# Altium project Nixie Alarm Clock - Base.PrjPcb
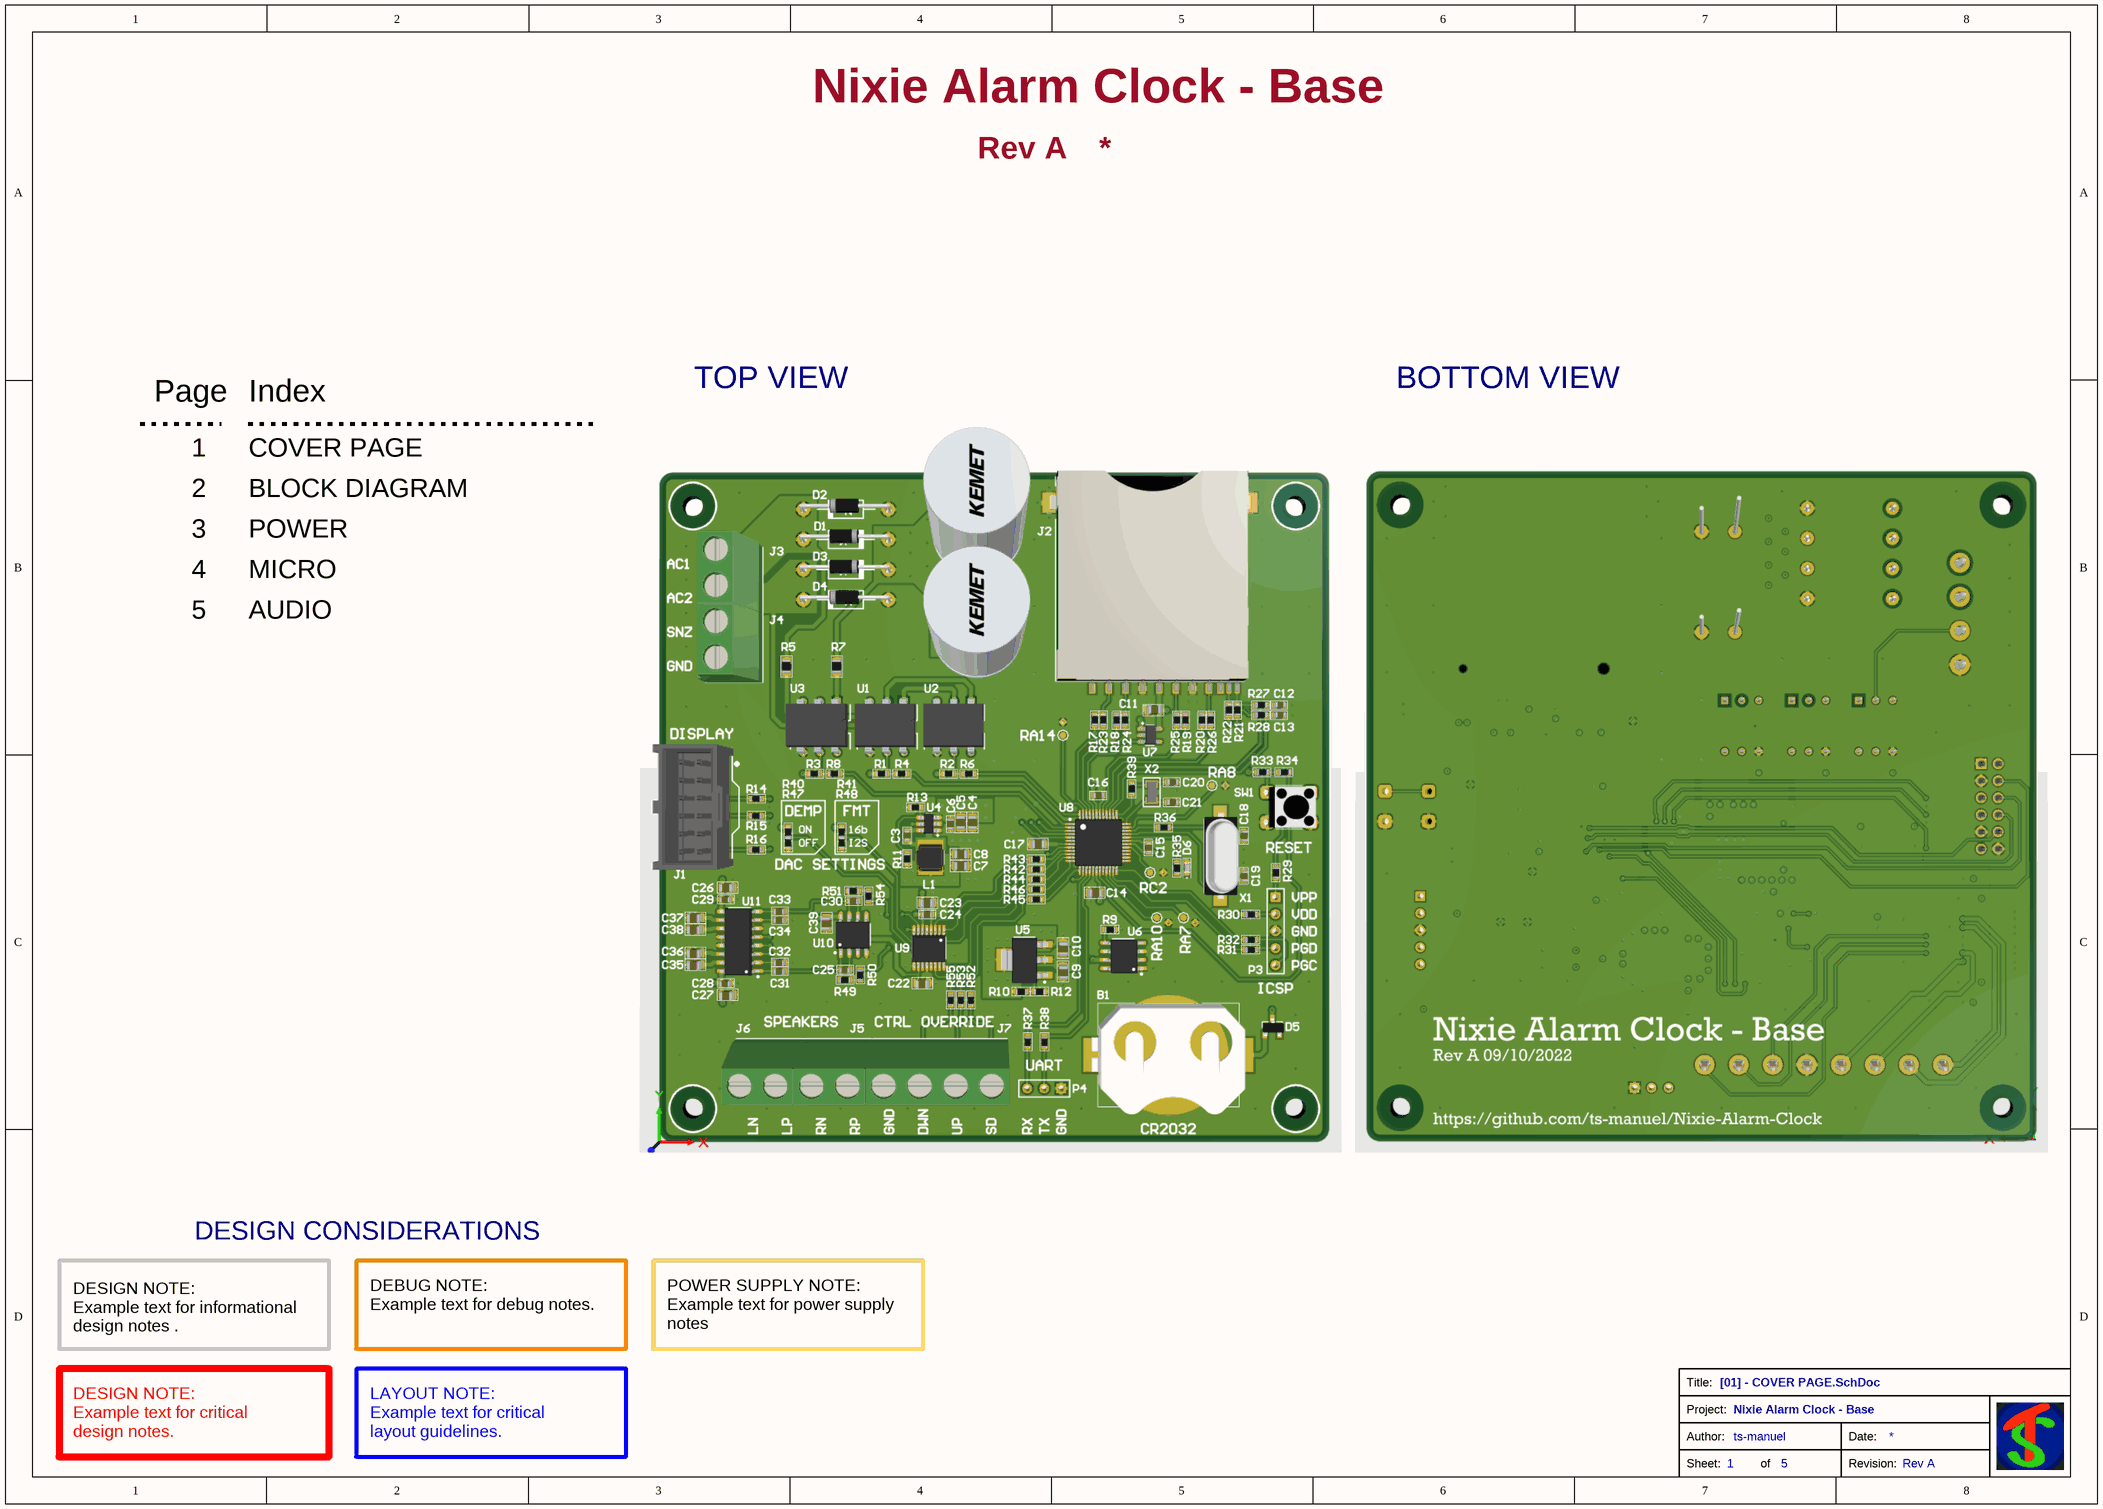
[diagram p0: [01] - COVER PAGE.SchDoc]
AuthorName: ts-manuel; GitHub: https://github.com/ts-manuel/Nixie-Alarm-Clock; ProjectRevision: Rev A; ProjectTitle: Nixie Alarm Clock - Base
5 sheets, 130 parts. Net scope: flat (ports and power ports of the same name join across sheets).
Board file: Base.PcbDoc
Sheets:
  [01] - COVER PAGE.SchDoc
  [02] - BLOCK DIAGRAM.SchDoc
  [03] - POWER.SchDoc
  [04] - MICRO.SchDoc
  [05] - AUDIO.SchDoc

## Sheet [01] - COVER PAGE.SchDoc
size A3; DocumentNumber: 1; SheetNumber: 1; SheetTotal: 5

### Notes on the sheet
- Page
- Index
- TOP VIEW
- BOTTOM VIEW
- 1
- 2
- COVER PAGE
- BLOCK DIAGRAM
- 3
- 4
- POWER
- MICRO
- 5
- AUDIO
- DESIGN CONSIDERATIONS
- DESIGN NOTE:
  Example text for informational
  design notes .
- DEBUG NOTE:
  Example text for debug notes.
- POWER SUPPLY NOTE:
  Example text for power supply notes
- DESIGN NOTE:
  Example text for critical
  design notes.
- LAYOUT NOTE:
  Example text for critical
  layout guidelines.
- Title:
- Project:
- Sheet:
- Author:
- of
- Revision:
- Date:

## Sheet [02] - BLOCK DIAGRAM.SchDoc
size A3; DocumentNumber: 2; SheetNumber: 2; SheetTotal: 5
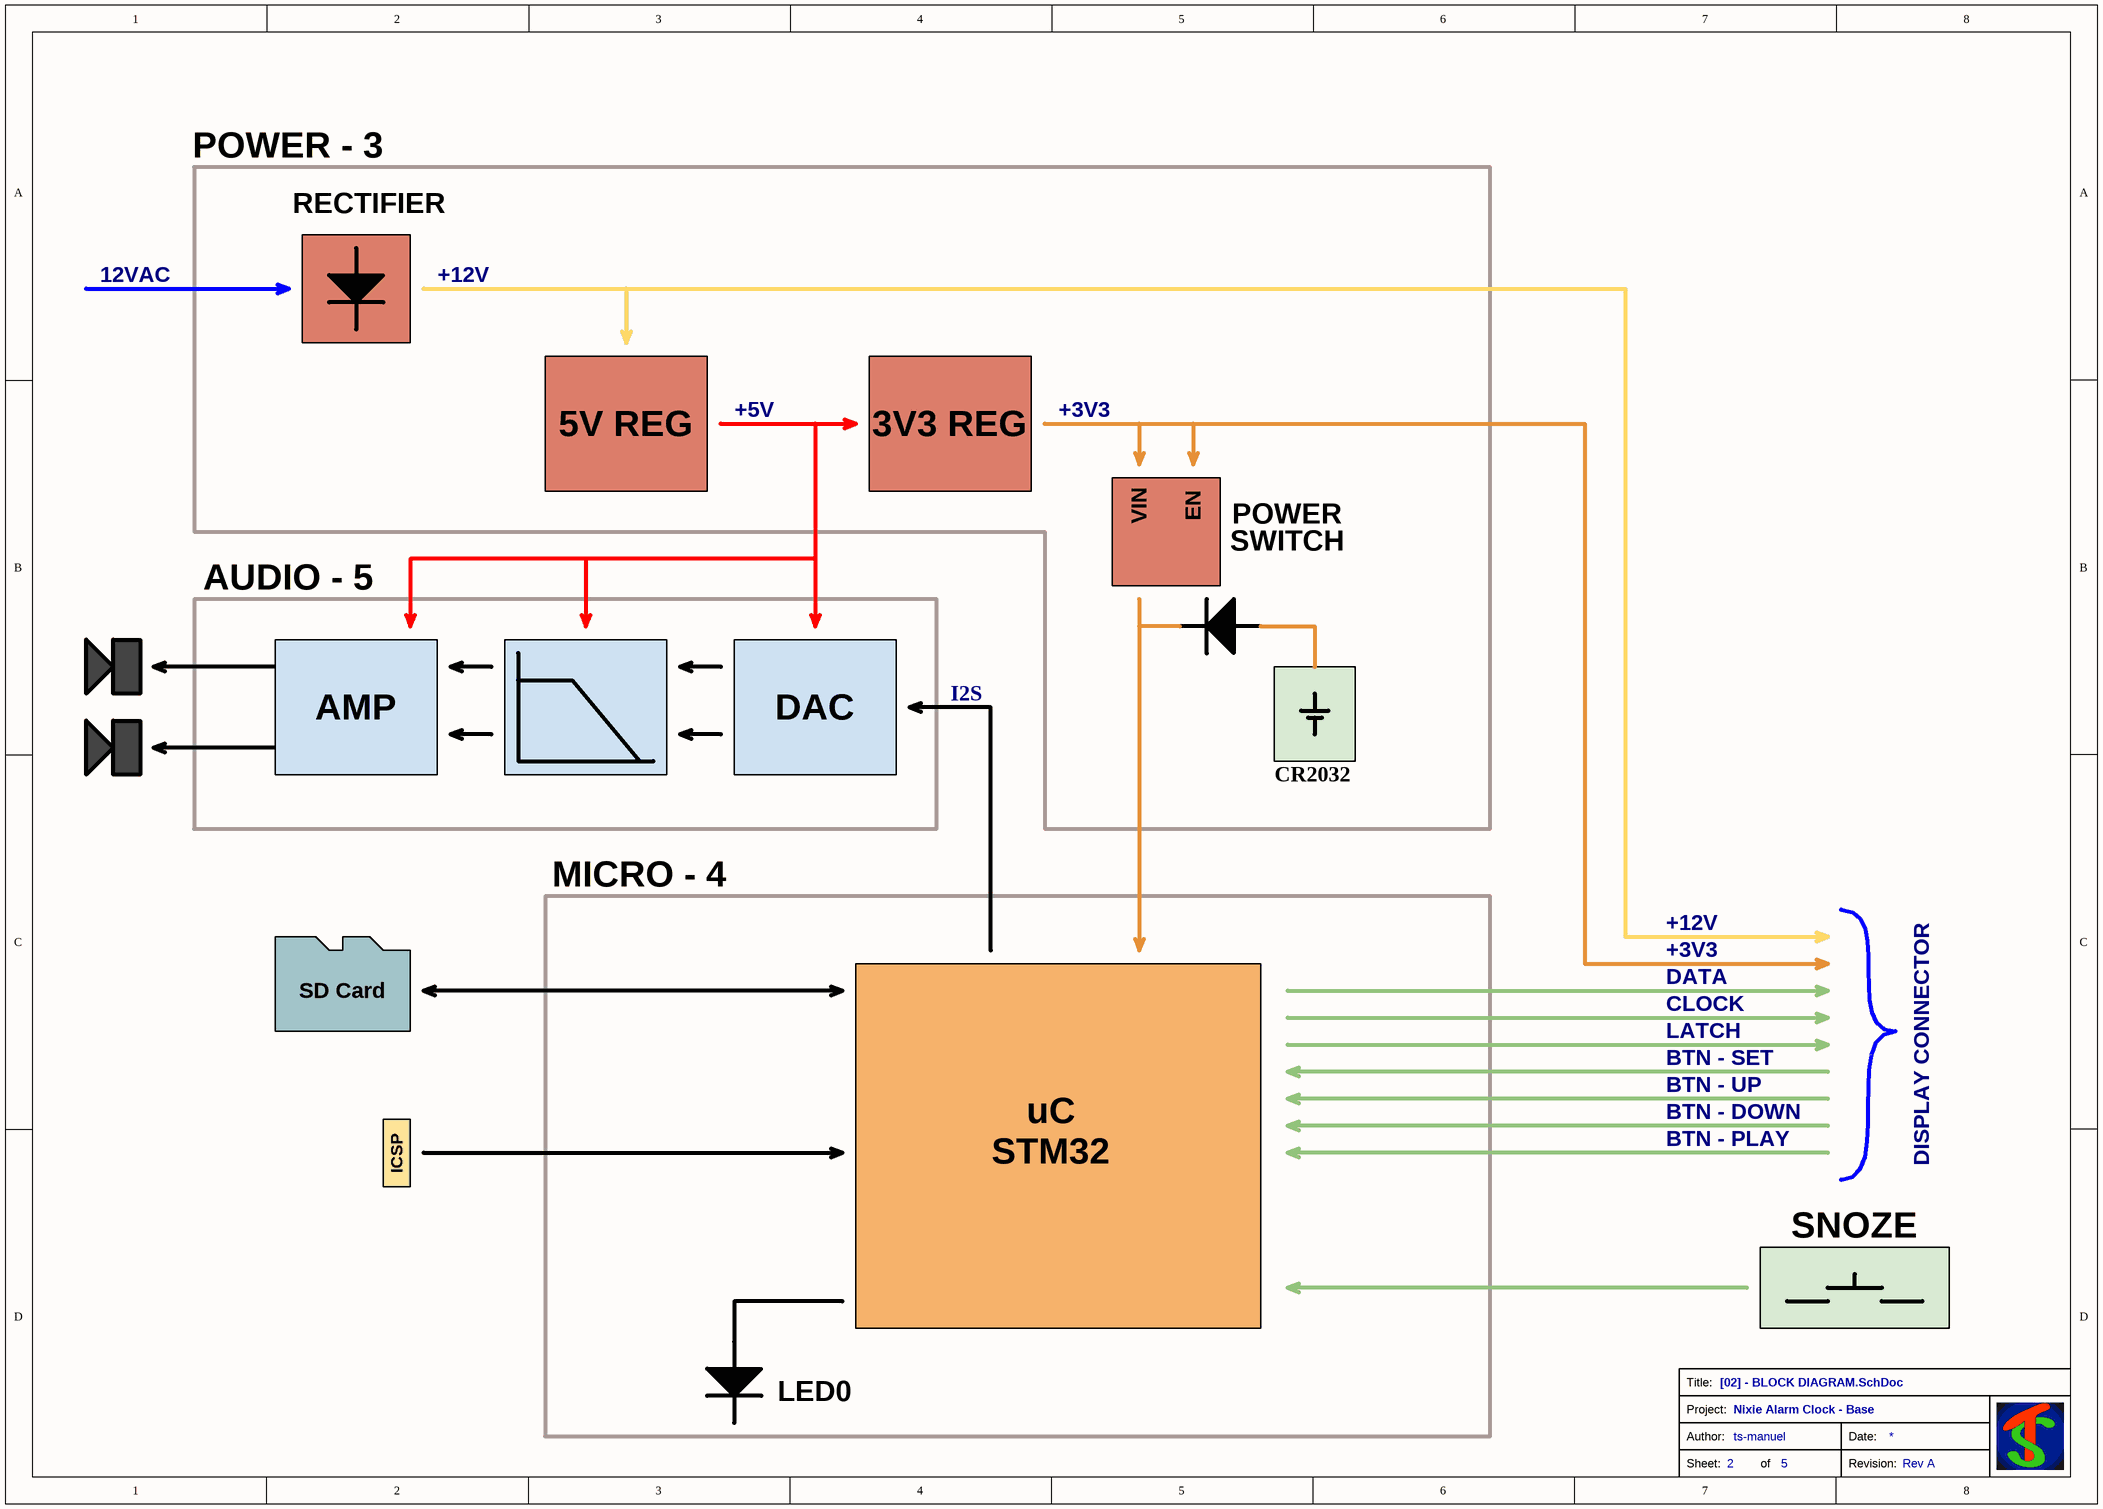
[diagram p1: [02] - BLOCK DIAGRAM.SchDoc]

### Notes on the sheet
- POWER - 3
- RECTIFIER
- 12VAC
- +12V
- 5V REG
- +5V
- 3V3 REG
- +3V3
- VIN
- EN
- SWITCH
- POWER
- AUDIO - 5
- AMP
- DAC
- I2S
- CR2032
- MICRO - 4
- SD Card
- DATA
- CLOCK
- LATCH
- uC
- BTN - SET
- BTN - UP
- BTN - DOWN
- ICSP
- STM32
- BTN - PLAY
- DISPLAY CONNECTOR
- SNOZE
- LED0
- Title:
- Project:
- Sheet:
- Author:
- of
- Revision:
- Date:

## Sheet [03] - POWER.SchDoc
size A3; DocumentNumber: 3; SheetNumber: 3; SheetTotal: 5
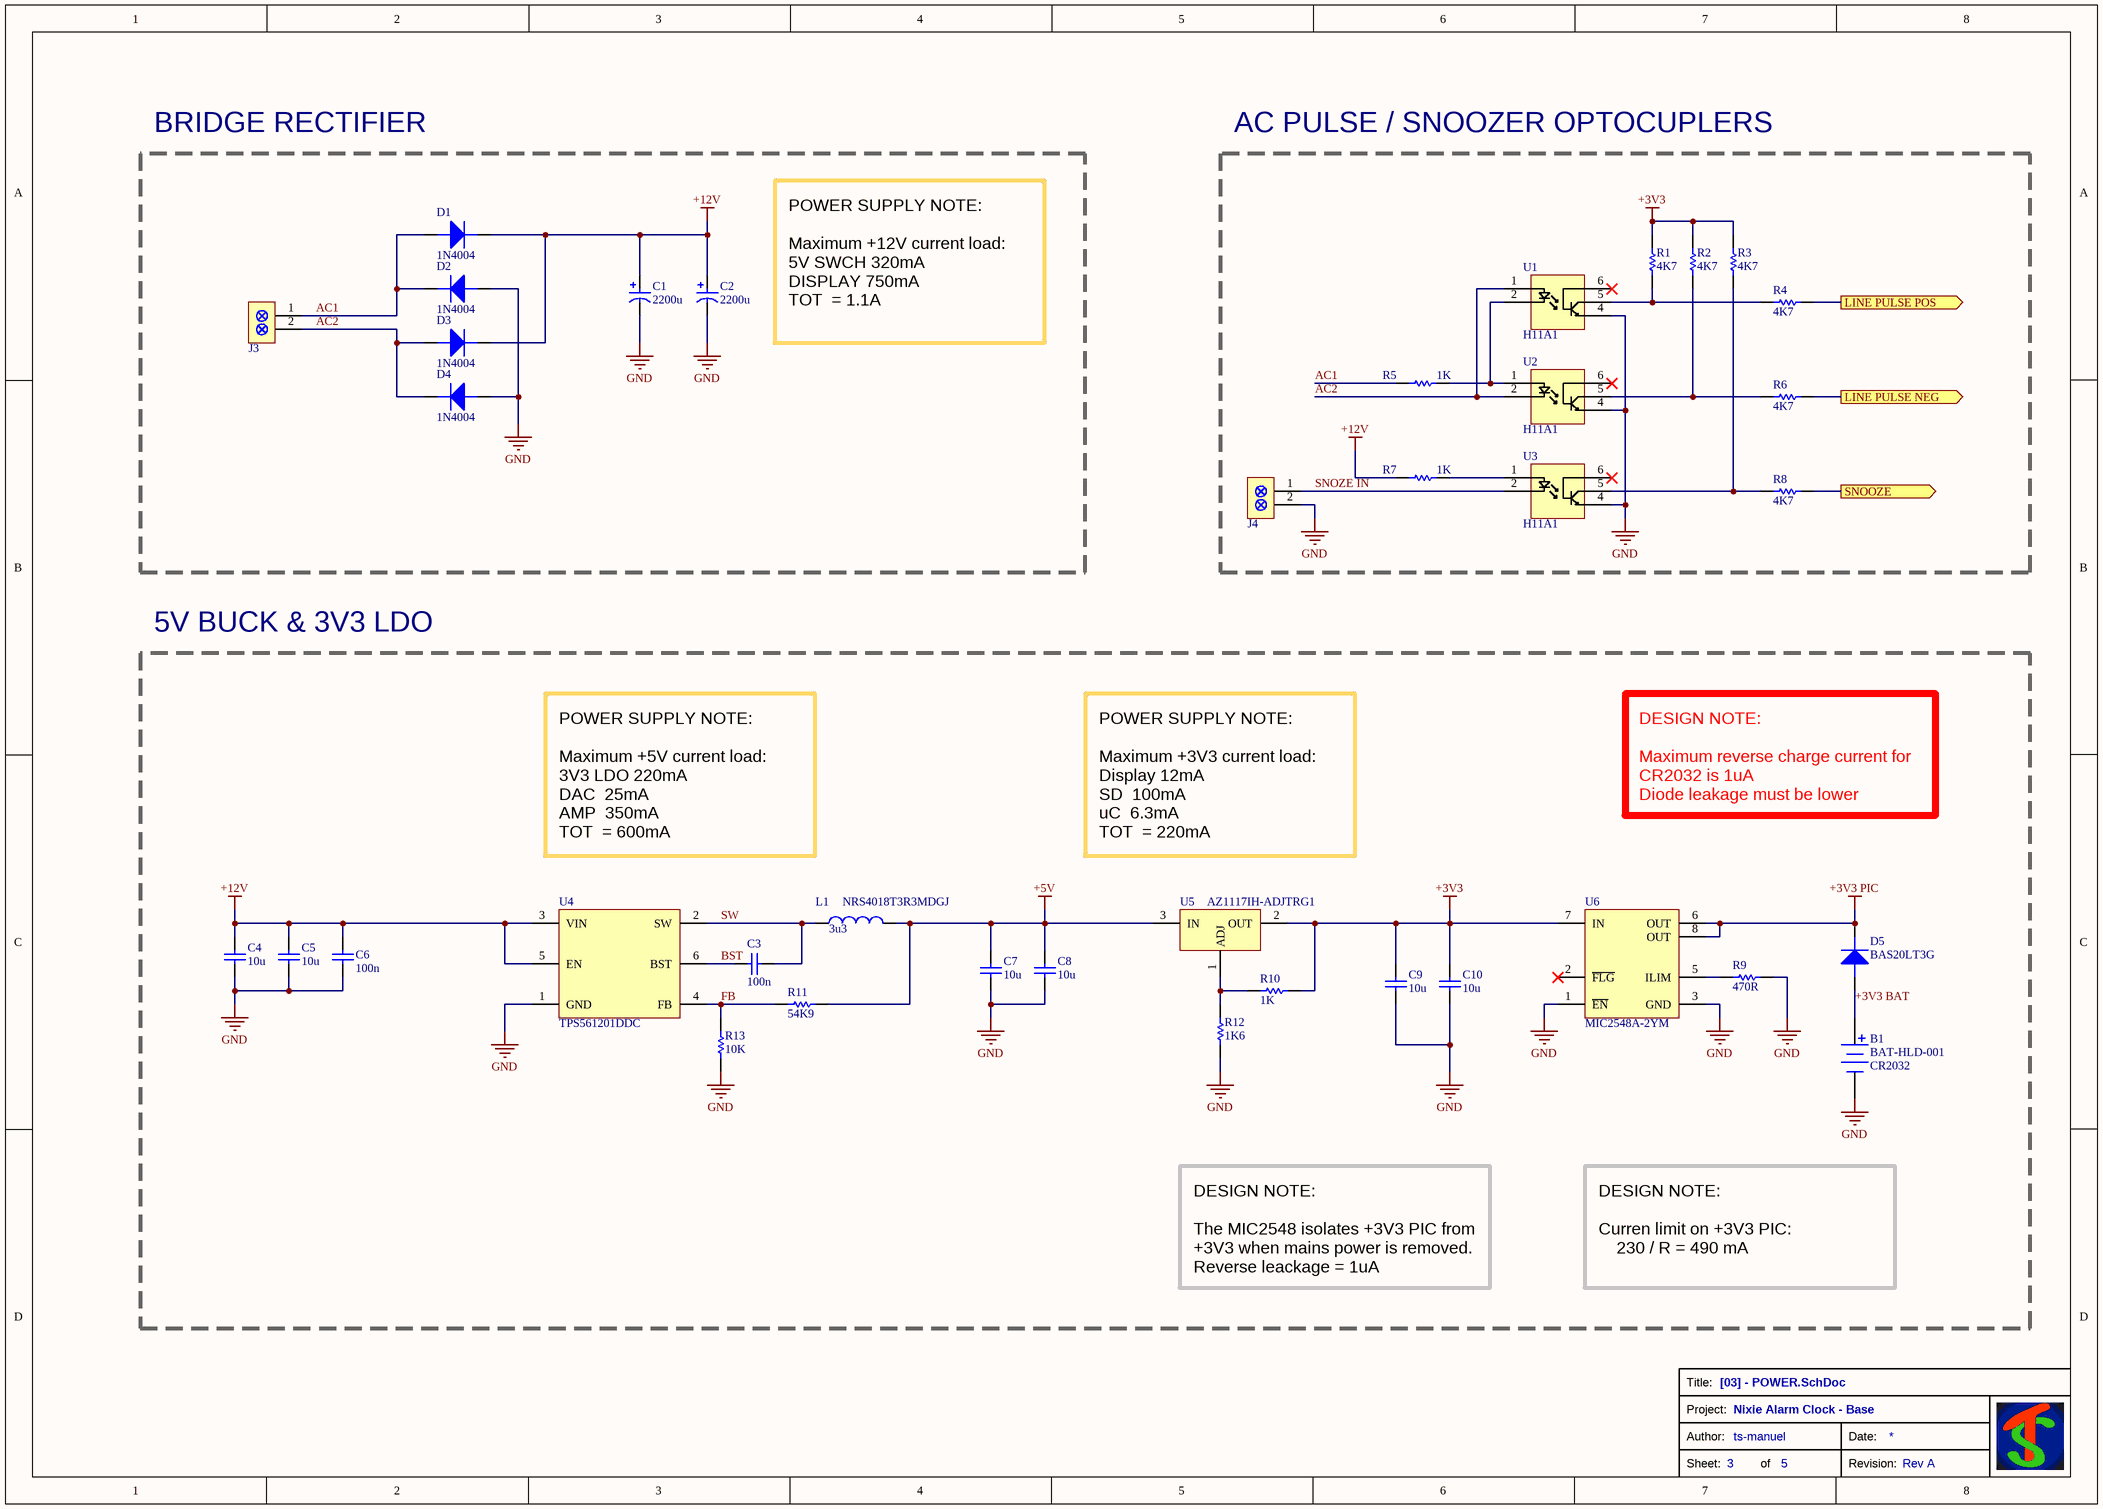
[diagram p2: [03] - POWER.SchDoc]

### Parts
B1  BAT-HLD-001  Size: CR2032  [BATHLD001-CR2032]
C1  value 2200u  [CAPPRD500W60D1300H2700]  (hidden comment: ESK228M025AL4AA)
C2  value 2200u  [CAPPRD500W60D1300H2700]  (hidden comment: ESK228M025AL4AA)
C3  value 100n  [CAP-0603]  (hidden comment: C0603C104M4RAC)
C4  value 10u  [CAP-0805]  (hidden comment: CL21A106KAYNNN)
C5  value 10u  [CAP-0805]  (hidden comment: CL21A106KAYNNN)
C6  value 100n  [CAP-0603]  (hidden comment: C0603C104M4RAC)
C7  value 10u  [CAP-0805]  (hidden comment: CL21A106KAYNNN)
C8  value 10u  [CAP-0805]  (hidden comment: CL21A106KAYNNN)
C9  value 10u  [CAP-0805]  (hidden comment: CL21A106KAYNNN)
C10  value 10u  [CAP-0805]  (hidden comment: CL21A106KAYNNN)
D1  1N4004  [DIODE-DO41]
D2  1N4004  [DIODE-DO41]
D3  1N4004  [DIODE-DO41]
D4  1N4004  [DIODE-DO41]
D5  BAS20LT3G  [SOT95P240X110-3N]
J3  SCREW-TH-BLOCK-200-2  [SCREW-TH-BLOCK-200-2]  (value not drawn)
J4  SCREW-TH-BLOCK-200-2  [SCREW-TH-BLOCK-200-2]  (value not drawn)
L1  NRS4018T3R3MDGJ  value 3u3  [INDP4040X18M]
R1  value 4K7  [RES-0603]  (hidden comment: RC0603FR-074K7L)
R2  value 4K7  [RES-0603]  (hidden comment: RC0603FR-074K7L)
R3  value 4K7  [RES-0603]  (hidden comment: RC0603FR-074K7L)
R4  value 4K7  [RES-0603]  (hidden comment: RC0603FR-074K7L)
R5  value 1K  [RES-0805]  (hidden comment: RC0805FR-071KL)
R6  value 4K7  [RES-0603]  (hidden comment: RC0603FR-074K7L)
R7  value 1K  [RES-0805]  (hidden comment: RC0805FR-071KL)
R8  value 4K7  [RES-0603]  (hidden comment: RC0603FR-074K7L)
R9  value 470R  [RES-0603]  (hidden comment: RC0603FR-07470RL)
R10  value 1K  [RES-0603]  (hidden comment: RC0603FR-071KL)
R11  value 54K9  [RES-0603]  (hidden comment: RC0603FR-0754K9L)
R12  value 1K6  [RES-0603]  (hidden comment: RC0603FR-071K6L)
R13  value 10K  [RES-0603]  (hidden comment: RC0603FR-0710KL)
U1  H11A1  [DIP762W51P254L889H508Q6N]
U2  H11A1  [DIP762W51P254L889H508Q6N]
U3  H11A1  [DIP762W51P254L889H508Q6N]
U4  TPS561201DDC  [SOT95P278X110-6N]
U5  AZ1117IH-ADJTRG1  [SOT230P700X180-4M]
U6  MIC2548A-2YM  [SOIC127P600X175-8N]

### Blocks framed on the sheet
BRIDGE RECTIFIER: C1 C2 D1-D4 J3
AC PULSE / SNOOZER OPTOCUPLERS: J4 R1-R8 U1-U3
5V BUCK & 3V3 LDO: B1 C3-C10 D5 L1 R9-R13 U4-U6

### Ports
LINE PULSE NEG (out), LINE PULSE POS (out), SNOOZE (out)

### Nets
+3V3: C9.1 C10.1 R1.2 R2.2 R3.2 R10.2 U5.2(OUT) U6.7(IN)
+3V3 PIC: D5.3(C) U6.6(OUT) U6.8(OUT)
+5V: C7.1 C8.1 L1.2 R11.2 U5.3(IN)
+12V: C1.1(P) C2.1(P) C4.1 C5.1 C6.1 D1.K(C) D3.K(C) R7.2 U4.3(VIN) U4.5(EN)
GND: B1.2(-) C1.2(N) C2.2(N) C4.2 C5.2 C6.2 C7.2 C8.2 C9.2 C10.2 D2.A D4.A J4.2 R9.2 R12.1 R13.1 U1.4(E) U2.4(E) U3.4(E) U4.1(GND) U6.1(~{EN}) U6.3(GND)
+3V3 BAT: B1.1(+) D5.1(A)
AC1: D1.A D2.K(C) J3.1 R5.2
AC2: D3.A D4.K(C) J3.2 U1.1(A) U2.2(K)
BST: C3.2 U4.6(BST)
FB: R11.1 R13.2 U4.4(FB)
LINE PULSE N: R6.1 ; port LINE PULSE NEG
LINE PULSE P: R4.1 ; port LINE PULSE POS
SNOOZE: R8.1 ; port SNOOZE
SNOZE IN: J4.1 U3.2(K)
SW: C3.1 L1.1 U4.2(SW)
NetR1_1: R1.1 R4.2 U1.5(C)
NetR2_1: R2.1 R6.2 U2.5(C)
NetR3_1: R3.1 R8.2 U3.5(C)
NetR5_1: R5.1 U1.2(K) U2.1(A)
NetR7_1: R7.1 U3.1(A)
NetR9_1: R9.1 U6.5(ILIM)
NetR10_1: R10.1 R12.2 U5.1(ADJ)

Not connected (* = marked no-connect by the designer): U1 6(B)*; U2 6(B)*; U3 6(B)*; U6 2(~{FLG})*

### Notes on the sheet
- POWER SUPPLY NOTE:
  Maximum +12V current load:
  5V SWCH	320mA
  DISPLAY	750mA
  TOT 	= 1.1A
- POWER SUPPLY NOTE:
  Maximum +5V current load:
  3V3 LDO	220mA
  DAC 	25mA
  AMP 	350mA
  TOT 	= 600mA
- POWER SUPPLY NOTE:
  Maximum +3V3 current load:
  Display	12mA
  SD 	100mA
  uC 	6.3mA
  TOT 	= 220mA
- DESIGN NOTE:
  Maximum reverse charge current for CR2032 is 1uA
  Diode leakage must be lower
- DESIGN NOTE:
  The MIC2548 isolates +3V3 PIC from +3V3 when mains power is removed.
  Reverse leackage = 1uA
- DESIGN NOTE:
  Curren limit on +3V3 PIC:
  230 / R = 490 mA
- Title:
- Project:
- Sheet:
- Author:
- of
- Revision:
- Date:

### Library data of the parts
B1 = CR2032-SMD-BAT-HLD-001: Portabatterie a celle a bottone Linx CR2032 Battery Holder; Supplier 1: Mouser; Supplier Part Number 1: 712-BAT-HLD-001
C1 C2 = CAP-RADIAL-2200u-25V-ALU-20%: ALU 25V 2200uF  RippleCurrent=1.3A 20%; Manufacturer: KEMET; Voltage Rating: 25V; Tolerance: 20%; Dielectric: ALU; Supplier 1: Mouser; Supplier Part Number 1: 80-ESK228M025AL4AA
C3 C6 = CAP-0603-100n-16V-X7R-20%: MLCC - SMD 16V 100nF X7R 0603 20%; Manufacturer: KEMET; Tolerance: 20%; Dielectric: X7R; Supplier 1: Mouser; Supplier Part Number 1: 80-C0603C104M4RAC; Voltage Rating: 16V
C4 C5 C7-C10 = CAP-0805-10u-25V-X5R-10%: MLCC - SMD 25V 10uF X5R 10%; Manufacturer: Samsung; Voltage Rating: 25; Tolerance: 10%; Dielectric: X5R; Supplier 1: Mouser; Supplier Part Number 1: 187-CL21A106KAYNNNE
D1-D4 = DIODE-1N4004-T: Silicon Diode - 400V 50uA 1A; Reverse Voltage: 400V; Forward Current: 1A; Leakage Current: 50uA; Supplier 1: Mouser; Supplier Part Number 1: 621-1N4004
D5 = DIODE-BAS20LT3G: Silicon Diode - 200V 0.1uA 200mA; Leakage Current: 100nA; Reverse Recovery Time: 50nS; Reverse Voltage: 200V; Forward Current: 200mA; Supplier 1: Mouser; Supplier Part Number 1: 863-BAS20LT3G
J3 J4 = SCREW-TH-BLOCK-200-2: Screw Therminal Block 200 mil Pitch 2 Contacts
L1 = IND-4018-3u3-NRS4018T3R3MDGJ: Fixed Inductor 4018 3.3uH 66mOhms +/-20%Tol 2300mA; Manufacturer: Taiyo Yuden; Tolerance: 20%; Max DC Current: 2.3A; Max DC Resistance: 66m; Supplier 1: Mouser; Supplier Part Number 1: 963-NRS4018T3R3MDGJ
R1-R4 R6 R8 = RES-0603-4K7-1/10W-1%: Thick Film - SMD 75V 1/10W 4.7K ohm 0603 1%; Manufacturer: Yageo; Power Rating: 1/10W; Voltage Rating: 75V; Tolerance: 1%; Supplier 1: Mouser; Supplier 2: Mouser; Supplier 3: Mouser; Supplier Part Number 3: 603-RC0603FR-134K7L; Supplier Part Number 2: 603-RC0603FR-104K7L; Supplier Part Number 1: 603-RC0603FR-074K7L
R5 R7 = RES-0805-1K-1/8W-1%: Thick Film - SMD 150V 1/8W 1K ohm 0805 1%; Manufacturer: Yageo; Power Rating: 1/8W; Voltage Rating: 150V; Tolerance: 1%; Supplier 1: Mouser; Supplier 2: Mouser; Supplier 3: Mouser; Supplier Part Number 3: 603-RC0805FR-131KL; Supplier Part Number 2: 603-RC0805FR-101KL; Supplier Part Number 1: 603-RC0805FR-071KL
R9 = RES-0603-470-1/10W-1%: Thick Film - SMD 75V 1/10W 470 ohm 0603 1%; Manufacturer: Yageo; Power Rating: 1/10W; Voltage Rating: 75V; Tolerance: 1%; Supplier 1: Mouser; Supplier 2: Mouser; Supplier 3: Mouser; Supplier Part Number 3: 603-RC0603FR-13470RL; Supplier Part Number 2: 603-RC0603FR-10470RL; Supplier Part Number 1: 603-RC0603FR-07470RL
R10 = RES-0603-1K-1/10W-1%: Thick Film - SMD 75V 1/10W 1K ohm 0603 1%; Manufacturer: Yageo; Power Rating: 1/10W; Voltage Rating: 75V; Tolerance: 1%; Supplier 1: Mouser; Supplier 2: Mouser; Supplier 3: Mouser; Supplier Part Number 3: 603-RC0603FR-131KL; Supplier Part Number 2: 603-RC0603FR-101KL; Supplier Part Number 1: 603-RC0603FR-071KL
R11 = RES-0603-54K9-1/10W-1%: Thick Film - SMD 75V 1/10W 54.9K ohm 0603 1%; Manufacturer: Yageo; Power Rating: 1/10W; Voltage Rating: 75V; Tolerance: 1%; Supplier 1: Mouser; Supplier 2: Mouser; Supplier Part Number 1: 603-RC0603FR-0754K9L; Supplier Part Number 2: 603-RC0603FR-1054K9L
R12 = RES-0603-1K6-1/10W-1%: Thick Film - SMD 75V 1/10W 1.6K ohm 0603 1%; Manufacturer: Yageo; Power Rating: 1/10W; Voltage Rating: 75V; Tolerance: 1%; Supplier 1: Mouser; Supplier 2: Mouser; Supplier 3: Mouser; Supplier Part Number 3: 603-RC0603FR-131K6L; Supplier Part Number 2: 603-RC0603FR-101K6L; Supplier Part Number 1: 603-RC0603FR-071K6L
R13 = RES-0603-10K-1/10W-1%: Thick Film - SMD 75V 1/10W 10K ohm 0603 1%; Manufacturer: Yageo; Power Rating: 1/10W; Voltage Rating: 75V; Tolerance: 1%; Supplier 1: Mouser; Supplier 2: Mouser; Supplier 3: Mouser; Supplier Part Number 2: 603-RC0603FR-1010KL; Supplier Part Number 1: 603-RC0603FR-0710KL; Supplier Part Number 3: 603-RC0603FR-1310KL
U1-U3 = OPTO-TH-H11A1: Optocoupler, Phototransistor Output, With Base Connection; Supplier 1: Mouser; Supplier Part Number 1: 782-H11A1
U4 = TPS561201DDC: 4.5-V to 17-V Input, 1-A Synchronous Step-Down Voltage Regulator; Supplier 1: Mouser; Supplier 2: Mouser; Supplier Part Number 2: 595-TPS561201DDCR; Supplier Part Number 1: 595-TPS561201DDCT
U5 = LDO-AZ1117IH-ADJ: LDO 15V Max 1.2V Dropout 1.35A Max; Vref: 1.25V; Minimum Load Current: 1.7mA; Supplier 1: Mouser; Supplier Part Number 1: 621-AZ1117IH-ADJTRG1; Input Voltage Maximum: 15V; Dropout Voltage: 1.2V; Current Limit: 1.35A
U6 = MIC2548A-2YM: Programmable Current-Limit High-Side Switch; Supplier 1: Mouser; Supplier Part Number 1: 998-MIC2548A-2YM

## Sheet [04] - MICRO.SchDoc
size A3; DocumentNumber: 4; SheetNumber: 4; SheetTotal: 5
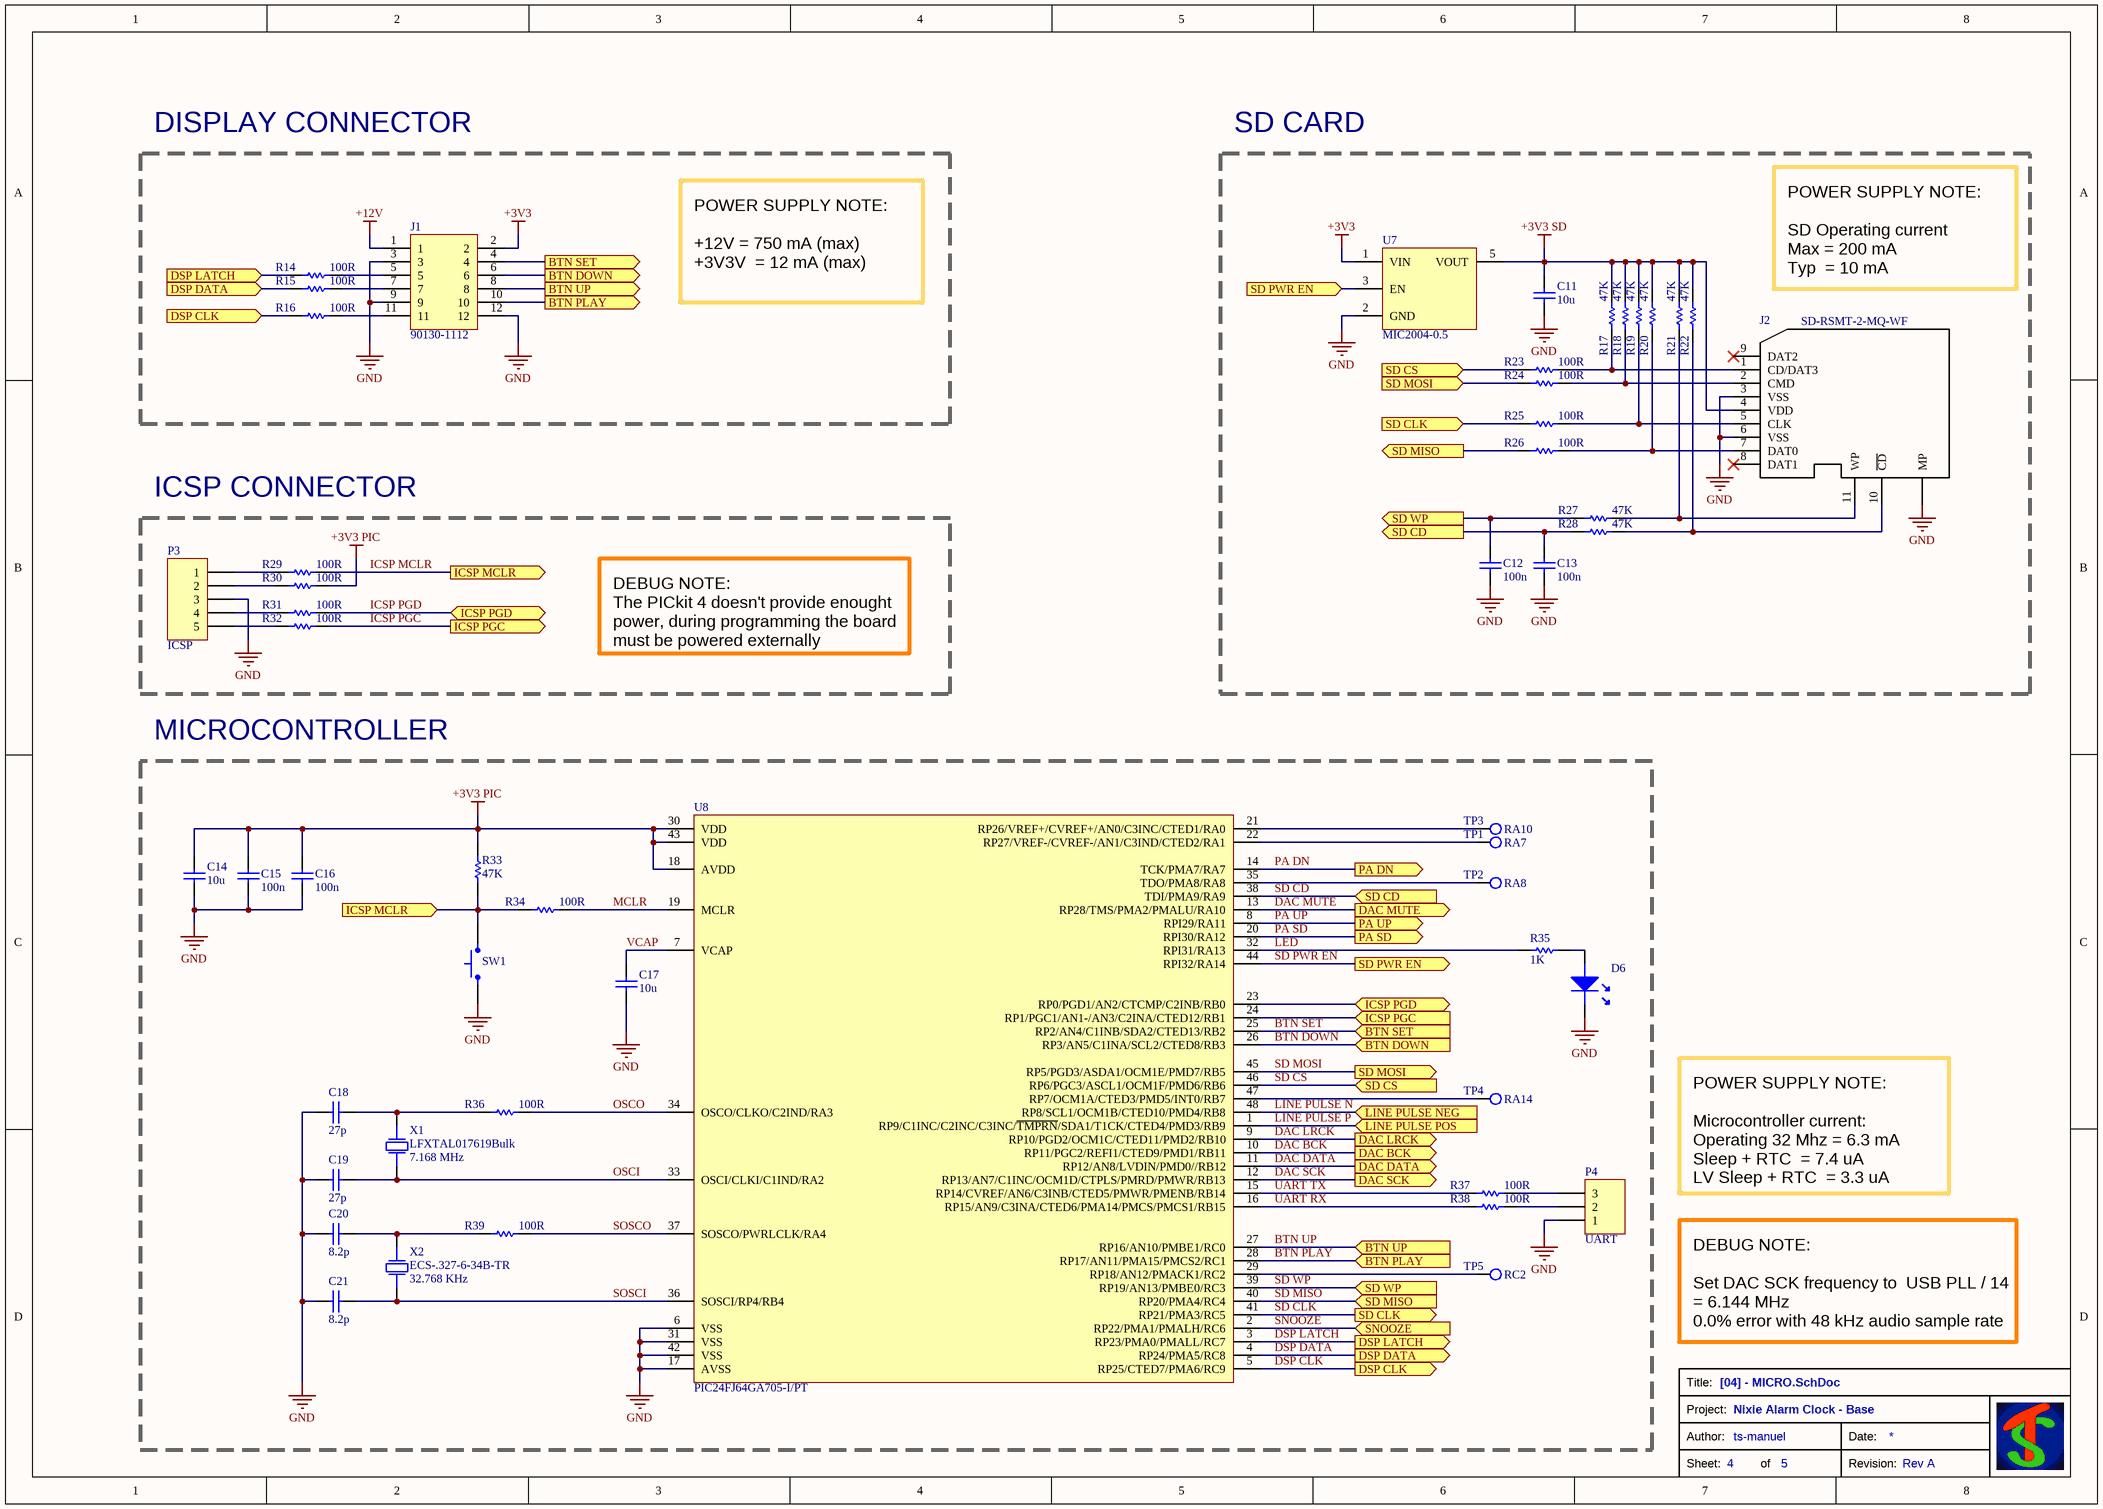
[diagram p3: [04] - MICRO.SchDoc]

### Parts
C11  value 10u  [CAP-0805]  (hidden comment: CL21A106KAYNNN)
C12  value 100n  [CAP-0603]  (hidden comment: C0603C104M4RAC)
C13  value 100n  [CAP-0603]  (hidden comment: C0603C104M4RAC)
C14  value 10u  [CAP-0805]  (hidden comment: CL21A106KAYNNN)
C15  value 100n  [CAP-0603]  (hidden comment: C0603C104M4RAC)
C16  value 100n  [CAP-0603]  (hidden comment: C0603C104M4RAC)
C17  value 10u  [CAP-0805]  (hidden comment: CL21A106KAYNNN)
C18  value 27p  [CAP-0603]  (hidden comment: C0603C270J5GACTU)
C19  value 27p  [CAP-0603]  (hidden comment: C0603C270J5GACTU)
C20  value 8.2p  [CAP-0603]  (hidden comment: CC0603JRNPO9BN8R2)
C21  value 8.2p  [CAP-0603]  (hidden comment: CC0603JRNPO9BN8R2)
D6  150060VS75000  [LED-SMD-0603-1.6X0.8]  (value not drawn)
J1  90130-1112  [SHDR12W65P254_2X6_1758X975X1110P]
J2  SD-RSMT-2-MQ-WF  [SD 3M SD-RSMT-2-MQ-WF]
P3  ICSP  [HDR1X5]
P4  UART  [HDR1X3]
R14  value 100R  [RES-0603]  (hidden comment: RC0603FR-07100RL)
R15  value 100R  [RES-0603]  (hidden comment: RC0603FR-07100RL)
R16  value 100R  [RES-0603]  (hidden comment: RC0603FR-07100RL)
R17  value 47K  [RES-0603]  (hidden comment: RC0603FR-0747KL)
R18  value 47K  [RES-0603]  (hidden comment: RC0603FR-0747KL)
R19  value 47K  [RES-0603]  (hidden comment: RC0603FR-0747KL)
R20  value 47K  [RES-0603]  (hidden comment: RC0603FR-0747KL)
R21  value 47K  [RES-0603]  (hidden comment: RC0603FR-0747KL)
R22  value 47K  [RES-0603]  (hidden comment: RC0603FR-0747KL)
R23  value 100R  [RES-0603]  (hidden comment: RC0603FR-07100RL)
R24  value 100R  [RES-0603]  (hidden comment: RC0603FR-07100RL)
R25  value 100R  [RES-0603]  (hidden comment: RC0603FR-07100RL)
R26  value 100R  [RES-0603]  (hidden comment: RC0603FR-07100RL)
R27  value 47K  [RES-0603]  (hidden comment: RC0603FR-0747KL)
R28  value 47K  [RES-0603]  (hidden comment: RC0603FR-0747KL)
R29  value 100R  [RES-0603]  (hidden comment: RC0603FR-07100RL)
R30  value 100R  [RES-0603]  (hidden comment: RC0603FR-07100RL)
R31  value 100R  [RES-0603]  (hidden comment: RC0603FR-07100RL)
R32  value 100R  [RES-0603]  (hidden comment: RC0603FR-07100RL)
R33  value 47K  [RES-0603]  (hidden comment: RC0603FR-0747KL)
R34  value 100R  [RES-0603]  (hidden comment: RC0603FR-07100RL)
R35  value 1K  [RES-0603]  (hidden comment: RC0603FR-071KL)
R36  value 100R  [RES-0603]  (hidden comment: RC0603FR-07100RL)
R37  value 100R  [RES-0603]  (hidden comment: RC0603FR-07100RL)
R38  value 100R  [RES-0603]  (hidden comment: RC0603FR-07100RL)
R39  value 100R  [RES-0603]  (hidden comment: RC0603FR-07100RL)
SW1  Push Button 6mm TH  [Push Button 6mm TH]  (value not drawn)
TP1  RA7  [TESTPOINT-1mm]  (no BOM)
TP2  RA8  [TESTPOINT-1mm]  (no BOM)
TP3  RA10  [TESTPOINT-1mm]  (no BOM)
TP4  RA14  [TESTPOINT-1mm]  (no BOM)
TP5  RC2  [TESTPOINT-1mm]  (no BOM)
U7  MIC2004-0.5  [SOT23-5]
U8  PIC24FJ64GA705-I/PT  [TSQFP50P900X900X120-48N]
X1  LFXTAL017619Bulk  value 7.168 MHz  [XTAL1140X490X430_HC49]
X2  ECS-.327-6-34B-TR  value 32.768 KHz  [XTAL-ECS-3.2 mm x 1.5 mm]

### Blocks framed on the sheet
DISPLAY CONNECTOR: J1 R14-R16
SD CARD: C11-C13 J2 R17-R28 U7
ICSP CONNECTOR: P3 R29-R32
MICROCONTROLLER: C14-C21 D6 P4 R33-R39 SW1 TP1-TP5 U8 X1 X2

### Ports
BTN DOWN (in), BTN DOWN (out), BTN PLAY (in), BTN PLAY (out), BTN SET (in), BTN SET (out), BTN UP (in), BTN UP (out), DAC BCK (out), DAC DATA (out), DAC LRCK (out), DAC MUTE (out), DAC SCK (out), DSP CLK (in), DSP CLK (out), DSP DATA (in), DSP DATA (out), DSP LATCH (in), DSP LATCH (out), ICSP MCLR (in), ICSP MCLR (out), ICSP PGC (in), ICSP PGC (out), ICSP PGD (bidir), LINE PULSE NEG (in), LINE PULSE POS (in), PA DN (out), PA SD (out), PA UP (out), SD CD (in), SD CD (out), SD CLK (in), SD CLK (out), SD CS (in), SD MISO (in), SD MISO (out), SD MOSI (in), SD MOSI (out), SD PWR EN (in), SD PWR EN (out), SD WP (in), SD WP (out), SNOOZE (in)

### Nets
+3V3: J1.2 U7.1(VIN)
+3V3 PIC: C14.1 C15.2 C16.2 R30.2 R33.2 U8.18(AVDD) U8.30(VDD) U8.43(VDD)
+3V3 SD: C11.1 J2.4(VDD) R17.2 R18.2 R19.2 R20.2 R21.2 R22.2 U7.5(VOUT)
+12V: J1.1
GND: C11.2 C12.1 C13.1 C14.2 C15.1 C16.1 C17.2 C18.2 C19.2 C20.2 C21.2 D6.K J1.3 J1.9 J1.12 J2.3(VSS) J2.6(VSS) J2.MP P3.3 P4.1 SW1.1 U7.2(GND) U8.6(VSS) U8.17(AVSS) U8.31(VSS) U8.42(VSS)
BTN DOWN: J1.6 U8.26(RP3/AN5/C1INA/SCL2/CTED8/RB3) ; port BTN DOWN
BTN PLAY: J1.10 U8.28(RP17/AN11/PMA15/PMCS2/RC1) ; port BTN PLAY
BTN SET: J1.4 U8.25(RP2/AN4/C1INB/SDA2/CTED13/RB2) ; port BTN SET
BTN UP: J1.8 U8.27(RP16/AN10/PMBE1/RC0) ; port BTN UP
DAC BCK: U8.10(RP11/PGC2/REFI1/CTED9/PMD1/RB11) ; port DAC BCK
DAC DATA: U8.11(RP12/AN8/LVDIN/PMD0//RB12) ; port DAC DATA
DAC LRCK: U8.9(RP10/PGD2/OCM1C/CTED11/PMD2/RB10) ; port DAC LRCK
DAC MUTE: U8.13(RP28/TMS/PMA2/PMALU/RA10) ; port DAC MUTE
DAC SCK: U8.12(RP13/AN7/C1INC/OCM1D/CTPLS/PMRD/PMWR/RB13) ; port DAC SCK
DSP CLK: R16.1 U8.5(RP25/CTED7/PMA6/RC9) ; port DSP CLK
DSP DATA: R15.1 U8.4(RP24/PMA5/RC8) ; port DSP DATA
DSP LATCH: R14.1 U8.3(RP23/PMA0/PMALL/RC7) ; port DSP LATCH
ICSP MCLR: R29.2 R33.1 R34.1 SW1.2 ; port ICSP MCLR
ICSP PGC: R32.2 U8.24(RP1/PGC1/AN1-/AN3/C2INA/CTED12/RB1) ; port ICSP PGC
ICSP PGD: R31.2 U8.23(RP0/PGD1/AN2/CTCMP/C2INB/RB0) ; port ICSP PGD
LED: R35.1 U8.32(RPI31/RA13)
LINE PULSE N: U8.48(RP8/SCL1/OCM1B/CTED10/PMD4/RB8) ; port LINE PULSE NEG
LINE PULSE P: U8.1(RP9/C1INC/C2INC/C3INC/~{TMPRN}/SDA1/T1CK/CTED4/PMD3/RB9) ; port LINE PULSE POS
MCLR: R34.2 U8.19(MCLR)
OSCI: C19.1 U8.33(OSCI/CLKI/C1IND/RA2) X1.1
OSCO: R36.2 U8.34(OSCO/CLKO/C2IND/RA3)
PA DN: U8.14(TCK/PMA7/RA7) ; port PA DN
PA SD: U8.20(RPI30/RA12) ; port PA SD
PA UP: U8.8(RPI29/RA11) ; port PA UP
SD CD: C13.2 R28.1 U8.38(TDI/PMA9/RA9) ; port SD CD
SD CLK: R25.1 U8.41(RP21/PMA3/RC5) ; port SD CLK
SD CS: R23.1 U8.46(RP6/PGC3/ASCL1/OCM1F/PMD6/RB6) ; port SD CS
SD MISO: R26.1 U8.40(RP20/PMA4/RC4) ; port SD MISO
SD MOSI: R24.1 U8.45(RP5/PGD3/ASDA1/OCM1E/PMD7/RB5) ; port SD MOSI
SD PWR EN: U7.3(EN) U8.44(RPI32/RA14) ; port SD PWR EN
SD WP: C12.2 R27.1 U8.39(RP19/AN13/PMBE0/RC3) ; port SD WP
SNOOZE: U8.2(RP22/PMA1/PMALH/RC6) ; port SNOOZE
SOSCI: C21.1 U8.36(SOSCI/RP4/RB4) X2.1
SOSCO: R39.2 U8.37(SOSCO/PWRLCLK/RA4)
UART RX: R38.1 U8.16(RP15/AN9/C3INA/CTED6/PMA14/PMCS/PMCS1/RB15)
UART TX: R37.1 U8.15(RP14/CVREF/AN6/C3INB/CTED5/PMWR/PMENB/RB14)
VCAP: C17.1 U8.7(VCAP)
NetC18_1: C18.1 R36.1 X1.2
NetC20_1: C20.1 R39.1 X2.2
NetD6_A: D6.A R35.2
NetJ1_5: J1.5 R14.2
NetJ1_7: J1.7 R15.2
NetJ1_11: J1.11 R16.2
NetJ2_1: J2.1(CD/DAT3) R17.1 R23.2
NetJ2_2: J2.2(CMD) R18.1 R24.2
NetJ2_5: J2.5(CLK) R19.1 R25.2
NetJ2_7: J2.7(DAT0) R20.1 R26.2
NetJ2_10: J2.10(~{CD}) R22.1 R28.2
NetJ2_11: J2.11(WP) R21.1 R27.2
NetP3_1: P3.1 R29.1
NetP3_2: P3.2 R30.1
NetP3_4: P3.4 R31.1
NetP3_5: P3.5 R32.1
NetP4_2: P4.2 R38.2
NetP4_3: P4.3 R37.2
NetTP1_1: TP1.1 U8.22(RP27/VREF-/CVREF-/AN1/C3IND/CTED2/RA1)
NetTP2_1: TP2.1 U8.35(TDO/PMA8/RA8)
NetTP3_1: TP3.1 U8.21(RP26/VREF+/CVREF+/AN0/C3INC/CTED1/RA0)
NetTP4_1: TP4.1 U8.47(RP7/OCM1A/CTED3/PMD5/INT0/RB7)
NetTP5_1: TP5.1 U8.29(RP18/AN12/PMACK1/RC2)

Not connected (* = marked no-connect by the designer): J2 8(DAT1)* 9(DAT2)*

### Notes on the sheet
- POWER SUPPLY NOTE:
  +12V	= 750 mA (max)
  +3V3V 	= 12 mA (max)
- POWER SUPPLY NOTE:
  SD Operating current
  Max	= 200 mA
  Typ 	= 10 mA
- DEBUG NOTE:
  The PICkit 4 doesn't provide enought power, during programming the board must be powered externally
- POWER SUPPLY NOTE:
  Microcontroller current:
  Operating 32 Mhz	= 6.3 mA
  Sleep + RTC 	= 7.4 uA
  LV Sleep + RTC 	= 3.3 uA
- DEBUG NOTE:
  Set DAC SCK frequency to  USB PLL / 14 = 6.144 MHz
  0.0% error with 48 kHz audio sample rate
- Title:
- Project:
- Sheet:
- Author:
- of
- Revision:
- Date:

### Library data of the parts
C11 C14 C17 = CAP-0805-10u-25V-X5R-10%: as C4 on sheet [03] - POWER; Tolerance: 10%; Dielectric: X5R; Supplier 1: Mouser; Supplier Part Number 1: 187-CL21A106KAYNNNE
C12 C13 C15 C16 = CAP-0603-100n-16V-X7R-20%: as C3 on sheet [03] - POWER; Tolerance: 20%; Dielectric: X7R; Supplier 1: Mouser; Supplier Part Number 1: 80-C0603C104M4RAC; Voltage Rating: 16V
C18 C19 = CAP-0603-27p-50V-NP0-5%: MLCC - SMD 50V 27pF NP0 0603 5%; Manufacturer: KEMET; Voltage Rating: 50V; Tolerance: 5%; Dielectric: NP0; Supplier 1: Mouser; Supplier Part Number 1: 80-C0603C270J5G
C20 C21 = CAP-0603-8p2-50V-NP0-5%: MLCC - SMD 50V 8.2pF NP0 0603 5%; Manufacturer: YAGEO; Voltage Rating: 50V; Tolerance: 5%; Dielectric: NP0; Supplier 1: Mouser; Supplier Part Number 1: 603-CC603JRNPO9BN8R2
D6 = LED-SMD-0603-Green-150060VS75000: Standard LEDs - SMD WL-SMCW SMDMono TpVw Waterclr 0603 BrtGrn; Manufacturer: Wurth Elektronik; Value: Green; Supplier 1: Mouser; Supplier Part Number 1: 710-150060VS75000
J1 = HEADER-12x2-2.54-TH-90130-1112: Terminali e capicorda 2.54MM CGRIDIII HDR 12P V DR SHRD TIN; Manufacturer_Name: Molex; Datasheet Link: https://www.molex.com/pdm_docs/sd/901301112_sd.pdf; Height: 11.1mm; Manufacturer_Part_Number: 90130-1112; Supplier 1: Mouser; Supplier Part Number 1: 538-90130-1112
J2 = SD-PUSH-PUSH-SD-RSMT-2-MQ-WF: Connettori per schede di memoria SD CARD CONNECTOR; Supplier 1: Mouser; Supplier Part Number 1: 517-SD-RSMT-2-MQ-WF
P3 = Header 5: Header, 5-Pin; LatestRevisionDate: 17-Jul-2002; LatestRevisionNote: Re-released for DXP Platform.; Publisher: Altium Limited
P4 = Header 3: Header, 3-Pin; LatestRevisionDate: 17-Jul-2002; LatestRevisionNote: Re-released for DXP Platform.; Publisher: Altium Limited
R14-R16 R23-R26 R29-R32 R34 R36-R39 = RES-0603-100R-1/10W-1%: Thick Film - SMD 75V 1/10W 100 ohm 0603 1%; Manufacturer: Yageo; Power Rating: 1/10W; Voltage Rating: 75V; Tolerance: 1%; Supplier 1: Mouser; Supplier Part Number 1: 603-RC0603FR-07100RL; Supplier 2: Mouser; Supplier 3: Mouser; Supplier Part Number 3: 603-RC0603FR-13100RL; Supplier Part Number 2: 603-RC0603FR-10100RL
R17-R22 R27 R28 R33 = RES-0603-47K-1/10W-1%: Thick Film - SMD 75V 1/10W 47K ohm 0603 1%; Manufacturer: Yageo; Power Rating: 1/10W; Voltage Rating: 75V; Tolerance: 1%; Supplier 1: Mouser; Supplier Part Number 1: 603-RC0603FR-0747KL; Supplier 2: Mouser; Supplier 3: Mouser; Supplier Part Number 3: 603-RC0603FR-1347KL; Supplier Part Number 2: 603-RC0603FR-1047KL
R35 = RES-0603-1K-1/10W-1%: as R10 on sheet [03] - POWER; Power Rating: 1/10W; Voltage Rating: 75V; Tolerance: 1%; Supplier 1: Mouser; Supplier 2: Mouser; Supplier 3: Mouser; Supplier Part Number 3: 603-RC0603FR-131KL; Supplier Part Number 2: 603-RC0603FR-101KL; Supplier Part Number 1: 603-RC0603FR-071KL
TP1-TP5 = TESTPOINT-SMD-1mm
U7 = MIC2004-0.5: Fixed 0.5A Current Limiting Power Distribution Switches; Supplier 1: Mouser; Supplier Part Number 1: 998-MIC2004-0.5YM5TR; Current Limit: 0.5A
U8 = PIC24FJ64GA705: Microcontrollori a 16 bit - MCU 16-bit, 16 MIPS, 64KB Flash, 16KB RAM; Supplier 1: Mouser; Supplier Part Number 1: 579-24FJ64GA705IPT
X1 = XTAL-SMD-7.168MHz: Crystal 7.168MHz 20ppm 30pF -10C +60C; Frequency Stability: 30 ppm; Drive Level: 500 uW; Load Capacitance: 30 pF; Frequency Tolerance: 20 ppm; Supplier 1: Mouser; Supplier Part Number 1: 449-LFXTAL017619BULK
X2 = XTAL-32.768KHz-ECS-.327-6-34B-TR: Crystal 32.768kHz 20ppm 6pF -40C +85C; Supplier 1: Mouser; Supplier Part Number 1: 520-.327-6-34BT; Load Capacitance: 6 pF

## Sheet [05] - AUDIO.SchDoc
size A3; DocumentNumber: 5; SheetNumber: 5; SheetTotal: 5
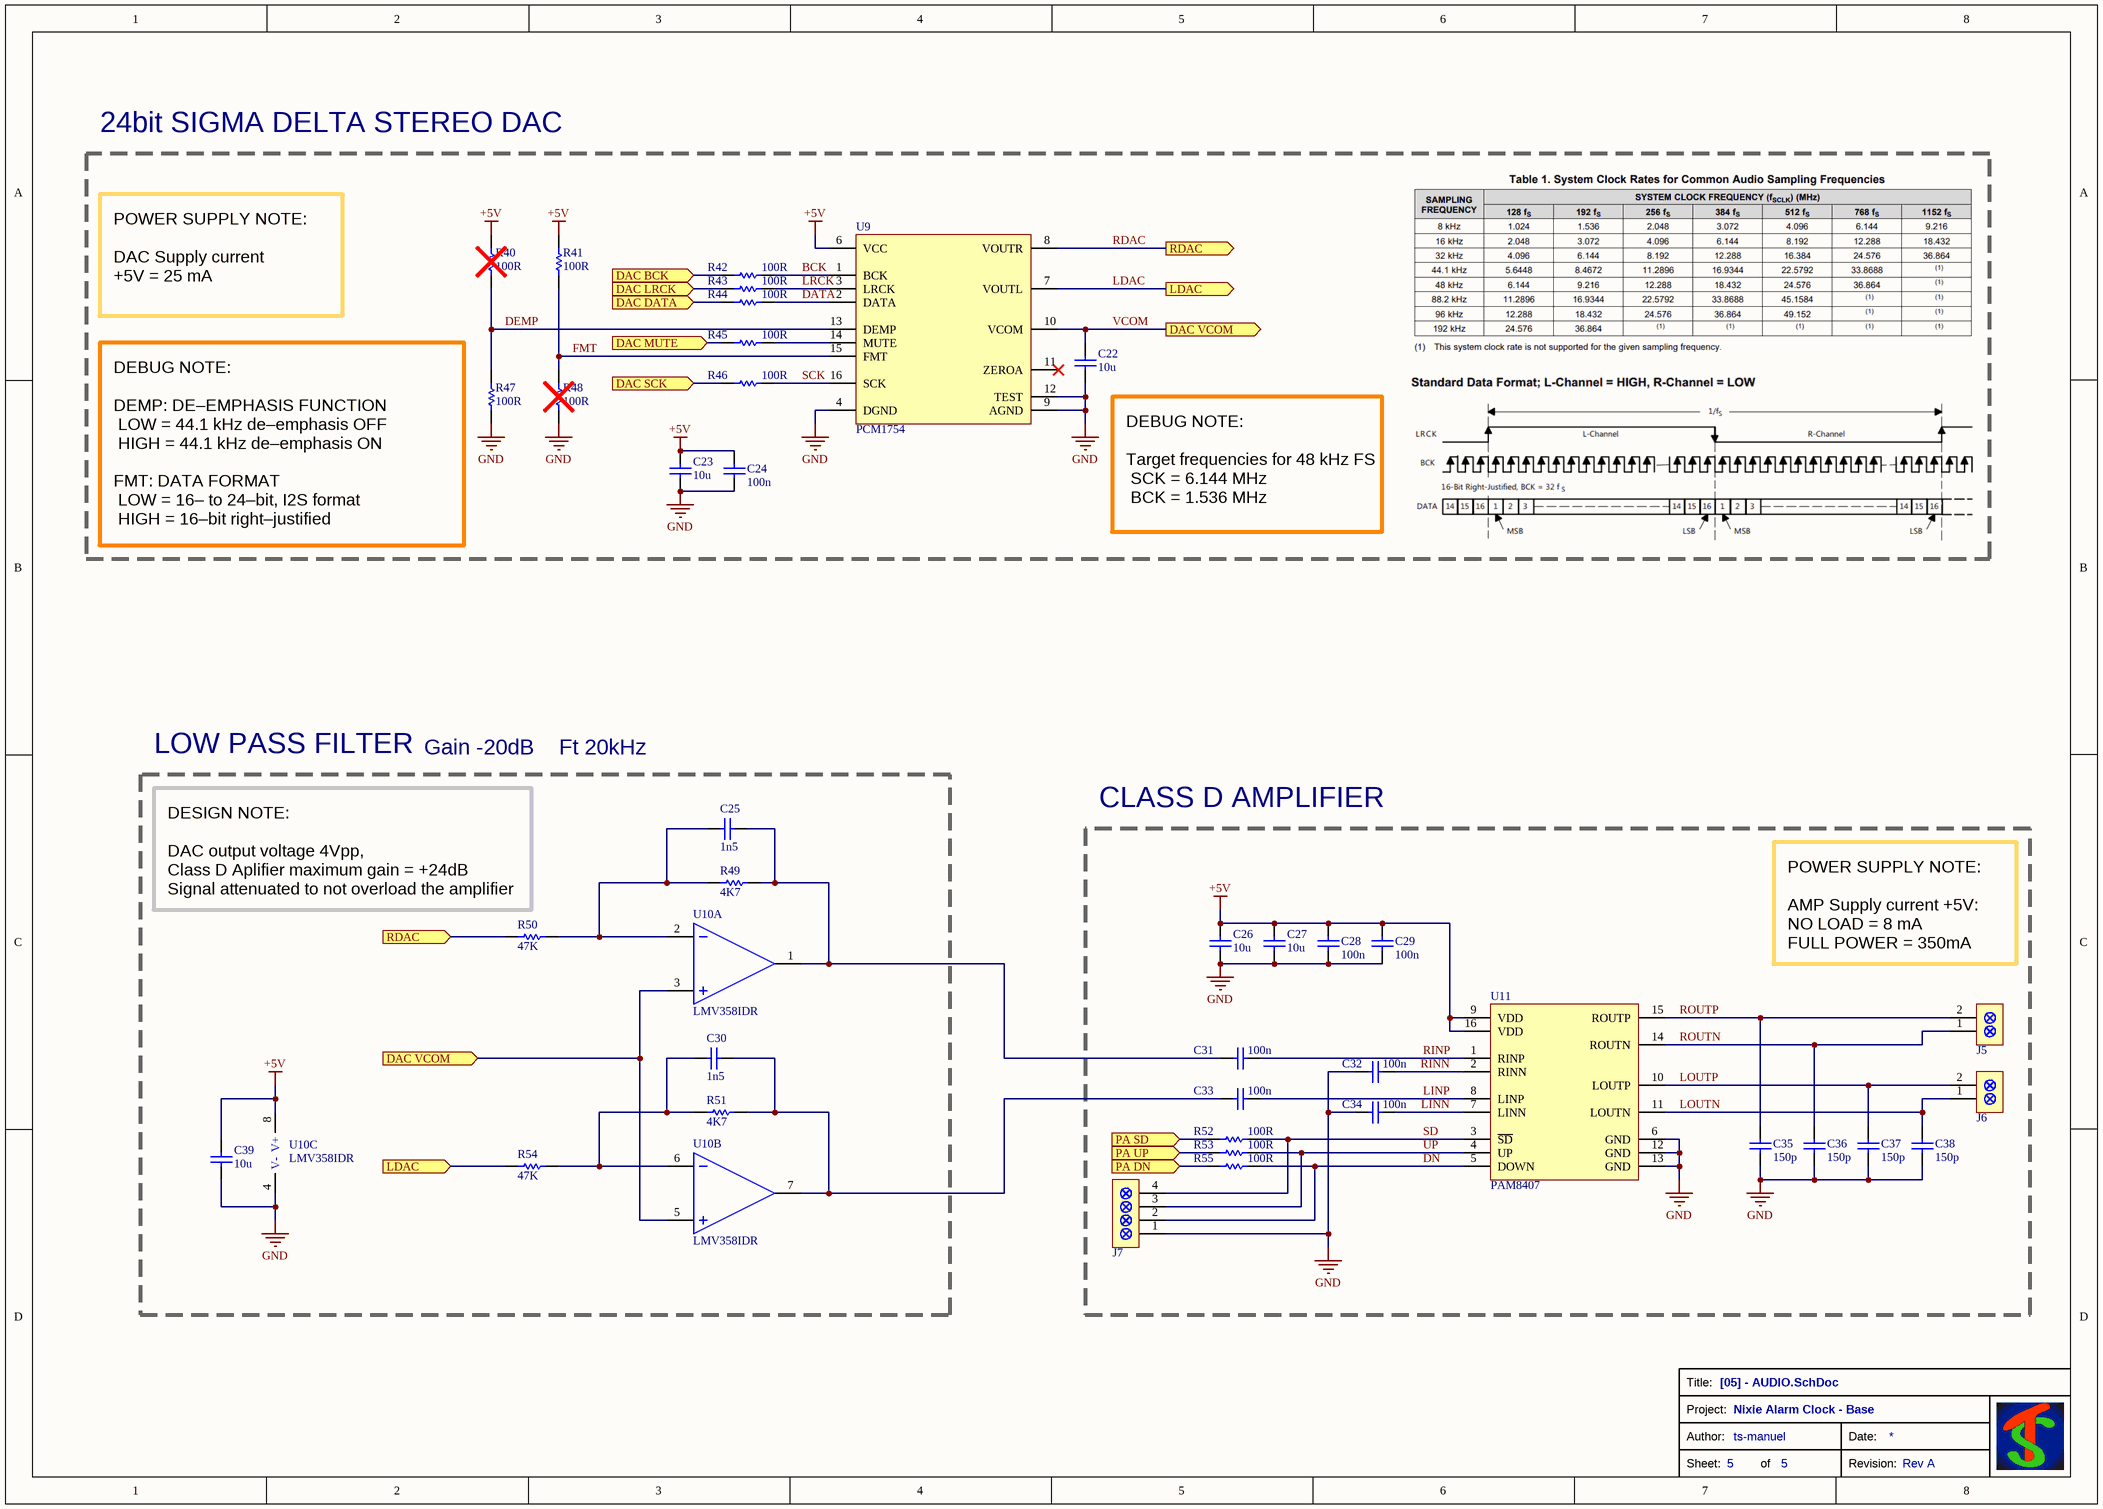
[diagram p4: [05] - AUDIO.SchDoc]

### Parts
C22  value 10u  [CAP-0805]  (hidden comment: CL21A106KAYNNN)
C23  value 10u  [CAP-0805]  (hidden comment: CL21A106KAYNNN)
C24  value 100n  [CAP-0603]  (hidden comment: C0603C104M4RAC)
C25  value 1n5  [CAP-0603]  (hidden comment: GRM1885C1H152JA01J)
C26  value 10u  [CAP-0805]  (hidden comment: CL21A106KAYNNN)
C27  value 10u  [CAP-0805]  (hidden comment: CL21A106KAYNNN)
C28  value 100n  [CAP-0603]  (hidden comment: C0603C104M4RAC)
C29  value 100n  [CAP-0603]  (hidden comment: C0603C104M4RAC)
C30  value 1n5  [CAP-0603]  (hidden comment: GRM1885C1H152JA01J)
C31  value 100n  [CAP-0603]  (hidden comment: C0603C104M4RAC)
C32  value 100n  [CAP-0603]  (hidden comment: C0603C104M4RAC)
C33  value 100n  [CAP-0603]  (hidden comment: C0603C104M4RAC)
C34  value 100n  [CAP-0603]  (hidden comment: C0603C104M4RAC)
C35  value 150p  [CAP-0805]  (hidden comment: 885012007083)
C36  value 150p  [CAP-0805]  (hidden comment: 885012007083)
C37  value 150p  [CAP-0805]  (hidden comment: 885012007083)
C38  value 150p  [CAP-0805]  (hidden comment: 885012007083)
C39  value 10u  [CAP-0805]  (hidden comment: CL21A106KAYNNN)
J5  SCREW-TH-BLOCK-200-2  [SCREW-TH-BLOCK-200-2]  (value not drawn)
J6  SCREW-TH-BLOCK-200-2  [SCREW-TH-BLOCK-200-2]  (value not drawn)
J7  SCREW-TH-BLOCK-200-4  [SCREW-TH-BLOCK-200-4]  (value not drawn)
R40  value 100R  [RES-0603]  (hidden comment: RC0603FR-07100RL)
R41  value 100R  [RES-0603]  (hidden comment: RC0603FR-07100RL)
R42  value 100R  [RES-0603]  (hidden comment: RC0603FR-07100RL)
R43  value 100R  [RES-0603]  (hidden comment: RC0603FR-07100RL)
R44  value 100R  [RES-0603]  (hidden comment: RC0603FR-07100RL)
R45  value 100R  [RES-0603]  (hidden comment: RC0603FR-07100RL)
R46  value 100R  [RES-0603]  (hidden comment: RC0603FR-07100RL)
R47  value 100R  [RES-0603]  (hidden comment: RC0603FR-07100RL)
R48  value 100R  [RES-0603]  (hidden comment: RC0603FR-07100RL)
R49  value 4K7  [RES-0603]  (hidden comment: RC0603FR-074K7L)
R50  value 47K  [RES-0603]  (hidden comment: RC0603FR-0747KL)
R51  value 4K7  [RES-0603]  (hidden comment: RC0603FR-074K7L)
R52  value 100R  [RES-0603]  (hidden comment: RC0603FR-07100RL)
R53  value 100R  [RES-0603]  (hidden comment: RC0603FR-07100RL)
R54  value 47K  [RES-0603]  (hidden comment: RC0603FR-0747KL)
R55  value 100R  [RES-0603]  (hidden comment: RC0603FR-07100RL)
U9  PCM1754  [SOP64P600X175-16N]
U10  LMV358IDR  [SOIC127P600X175-8N]  (parts A,B,C of 3)
U11  PAM8407  [SOIC127P600X175-16N]

### Blocks framed on the sheet
24bit SIGMA DELTA STEREO DAC: C22-C24 R40-R48 U9
LOW PASS FILTER: C25 C30 C39 R49-R51 R54 U10
CLASS D AMPLIFIER: C26-C29 C31-C38 J5-J7 R52 R53 R55 U11

### Ports
DAC BCK (in), DAC DATA (in), DAC LRCK (in), DAC MUTE (in), DAC SCK (in), DAC VCOM (in), DAC VCOM (out), LDAC (in), LDAC (out), PA DN (in), PA SD (in), PA UP (in), RDAC (in), RDAC (out)

### Nets
+5V: C23.1 C24.2 C26.1 C27.1 C28.2 C29.2 C39.1 R40.2 R41.2 U9.6(VCC) U10.8(V+) U11.9(VDD) U11.16(VDD)
GND: C22.2 C23.2 C24.1 C26.2 C27.2 C28.1 C29.1 C32.1 C34.1 C35.1 C36.1 C37.1 C38.1 C39.2 J7.1 R47.1 R48.1 U9.4(DGND) U9.9(AGND) U9.12(TEST) U10.4(V-) U11.6(GND) U11.12(GND) U11.13(GND)
BCK: R42.2 U9.1(BCK)
DAC BCK: R42.1 ; port DAC BCK
DAC DATA: R44.1 ; port DAC DATA
DAC LRCK: R43.1 ; port DAC LRCK
DAC MUTE: R45.1 ; port DAC MUTE
DAC SCK: R46.1 ; port DAC SCK
DATA: R44.2 U9.2(DATA)
DEMP: R40.1 R47.2 U9.13(DEMP)
DN: J7.2 R55.2 U11.5(DOWN)
FMT: R41.1 R48.2 U9.15(FMT)
LDAC: R54.2 U9.7(VOUTL) ; port LDAC
LINN: C34.2 U11.7(LINN)
LINP: C33.2 U11.8(LINP)
LOUTN: C38.2 J6.1 U11.11(LOUTN)
LOUTP: C37.2 J6.2 U11.10(LOUTP)
LRCK: R43.2 U9.3(LRCK)
PA DN: R55.1 ; port PA DN
PA SD: R52.1 ; port PA SD
PA UP: R53.1 ; port PA UP
RDAC: R50.2 U9.8(VOUTR) ; port RDAC
RINN: C32.2 U11.2(RINN)
RINP: C31.2 U11.1(RINP)
ROUTN: C36.2 J5.1 U11.14(ROUTN)
ROUTP: C35.2 J5.2 U11.15(ROUTP)
SCK: R46.2 U9.16(SCK)
SD: J7.4 R52.2 U11.3(~{SD})
UP: J7.3 R53.2 U11.4(UP)
VCOM: C22.1 U9.10(VCOM) U10.3(1IN+) U10.5(2IN+) ; port DAC VCOM
NetC25_1: C25.1 R49.1 R50.1 U10.2(1IN-)
NetC25_2: C25.2 C31.1 R49.2 U10.1(1OUT)
NetC30_1: C30.1 R51.1 R54.1 U10.6(2IN-)
NetC30_2: C30.2 C33.1 R51.2 U10.7(2OUT)
NetR45_2: R45.2 U9.14(MUTE)

Not connected (* = marked no-connect by the designer): U9 11(ZEROA)*

### Notes on the sheet
- POWER SUPPLY NOTE:
  DAC Supply current
  +5V	= 25 mA
- DEBUG NOTE:
  Target frequencies for 48 kHz FS
  SCK = 6.144 MHz
  BCK = 1.536 MHz
- (near R47) DEBUG NOTE:
  DEMP: DE–EMPHASIS FUNCTION
  LOW = 44.1 kHz de–emphasis OFF
  HIGH = 44.1 kHz de–emphasis ON
  FMT: DATA FORMAT
  LOW = 16– to 24–bit, I2S format
  HIGH = 16–bit right–justified
- Gain -20dB
- Ft 20kHz
- (near R50) DESIGN NOTE:
  DAC output voltage 4Vpp,
  Class D Aplifier maximum gain = +24dB
  Signal attenuated to not overload the amplifier
- POWER SUPPLY NOTE:
  AMP Supply current +5V:
  NO LOAD = 8 mA
  FULL POWER = 350mA
- Title:
- Project:
- Sheet:
- Author:
- of
- Revision:
- Date:

### Library data of the parts
C22 C23 C26 C27 C39 = CAP-0805-10u-25V-X5R-10%: as C4 on sheet [03] - POWER; Tolerance: 10%; Dielectric: X5R; Supplier 1: Mouser; Supplier Part Number 1: 187-CL21A106KAYNNNE
C24 C28 C29 C31-C34 = CAP-0603-100n-16V-X7R-20%: as C3 on sheet [03] - POWER; Tolerance: 20%; Dielectric: X7R; Supplier 1: Mouser; Supplier Part Number 1: 80-C0603C104M4RAC; Voltage Rating: 16V
C25 C30 = CAP-0603-1n5-50V-NP0-5%: MLCC - SMD 50V 1.5nF NP0 0603 5%; Manufacturer: Murata; Voltage Rating: 50V; Tolerance: 5%; Dielectric: NP0; Supplier 1: Mouser; Supplier Part Number 1: 81-GRM185C1H152JA01J
C35-C38 = CAP-0805-150p-100V-NP0-5%: MLCC - SMD 100V 150pF NP0 0805 5%; Manufacturer: Wurth Electronics; Supplier 1: Mouser; Supplier Part Number 1: 710-885012007083; Voltage Rating: 100V; Dielectric: NP0; Tollerance: 5%
J5 J6 = SCREW-TH-BLOCK-200-2: as J3 on sheet [03] - POWER
J7 = SCREW-TH-BLOCK-200-4: Screw Therminal Block 200 mil Pitch 4 Contacts
R40-R48 R52 R53 R55 = RES-0603-100R-1/10W-1%: as R14 on sheet [04] - MICRO; Power Rating: 1/10W; Voltage Rating: 75V; Tolerance: 1%; Supplier 1: Mouser; Supplier Part Number 1: 603-RC0603FR-07100RL; Supplier 2: Mouser; Supplier 3: Mouser; Supplier Part Number 3: 603-RC0603FR-13100RL; Supplier Part Number 2: 603-RC0603FR-10100RL
R49 R51 = RES-0603-4K7-1/10W-1%: as R1 on sheet [03] - POWER; Power Rating: 1/10W; Voltage Rating: 75V; Tolerance: 1%; Supplier 1: Mouser; Supplier 2: Mouser; Supplier 3: Mouser; Supplier Part Number 3: 603-RC0603FR-134K7L; Supplier Part Number 2: 603-RC0603FR-104K7L; Supplier Part Number 1: 603-RC0603FR-074K7L
R50 R54 = RES-0603-47K-1/10W-1%: as R17 on sheet [04] - MICRO; Power Rating: 1/10W; Voltage Rating: 75V; Tolerance: 1%; Supplier 1: Mouser; Supplier Part Number 1: 603-RC0603FR-0747KL; Supplier 2: Mouser; Supplier 3: Mouser; Supplier Part Number 3: 603-RC0603FR-1347KL; Supplier Part Number 2: 603-RC0603FR-1047KL
U9 = DAC-STEREO-24bit-PCM1754: Circuiti integrati convertitori D/A audio 24-Bit 192kHz Stereo Audio DAC; Supplier 1: Mouser; Supplier Part Number 1: 595-PCM1754DBQR
U10 = OPAMP-FET-LMV358IDR-TI: Low-Voltage Rail-to-Rail Output FET Input Dual Operational Amplifier; Manufacturer: Texas Instruments; Supplier 1: Mouser; Supplier Part Number 1: 595-LMV358IDR
U11 = PAM8407: 2x3W Stereo Differential Input Class D Audio Amplifier / with Up/Down Volume Control; Supplier 1: Mouser; Supplier Part Number 1: 621-PAM8407DR

## Nets that join several sheets
+3V3: [03] - POWER (8 pins), [04] - MICRO (J1.2 U7.1)
+3V3 PIC: [03] - POWER (D5.3 U6.6 U6.8), [04] - MICRO (8 pins)
+5V: [03] - POWER (5 pins), [05] - AUDIO (13 pins)
+12V: [03] - POWER (10 pins), [04] - MICRO (J1.1)
GND: [03] - POWER (22 pins), [04] - MICRO (26 pins), [05] - AUDIO (24 pins)
DAC BCK: [04] - MICRO (U8.10), [05] - AUDIO (R42.1)
DAC DATA: [04] - MICRO (U8.11), [05] - AUDIO (R44.1)
DAC LRCK: [04] - MICRO (U8.9), [05] - AUDIO (R43.1)
DAC MUTE: [04] - MICRO (U8.13), [05] - AUDIO (R45.1)
DAC SCK: [04] - MICRO (U8.12), [05] - AUDIO (R46.1)
LINE PULSE N: [03] - POWER (R6.1), [04] - MICRO (U8.48)
LINE PULSE P: [03] - POWER (R4.1), [04] - MICRO (U8.1)
PA DN: [04] - MICRO (U8.14), [05] - AUDIO (R55.1)
PA SD: [04] - MICRO (U8.20), [05] - AUDIO (R52.1)
PA UP: [04] - MICRO (U8.8), [05] - AUDIO (R53.1)
SNOOZE: [03] - POWER (R8.1), [04] - MICRO (U8.2)